# EAGLE design PiGRRL-ButtonPCB (EAGLE 7.5.0)
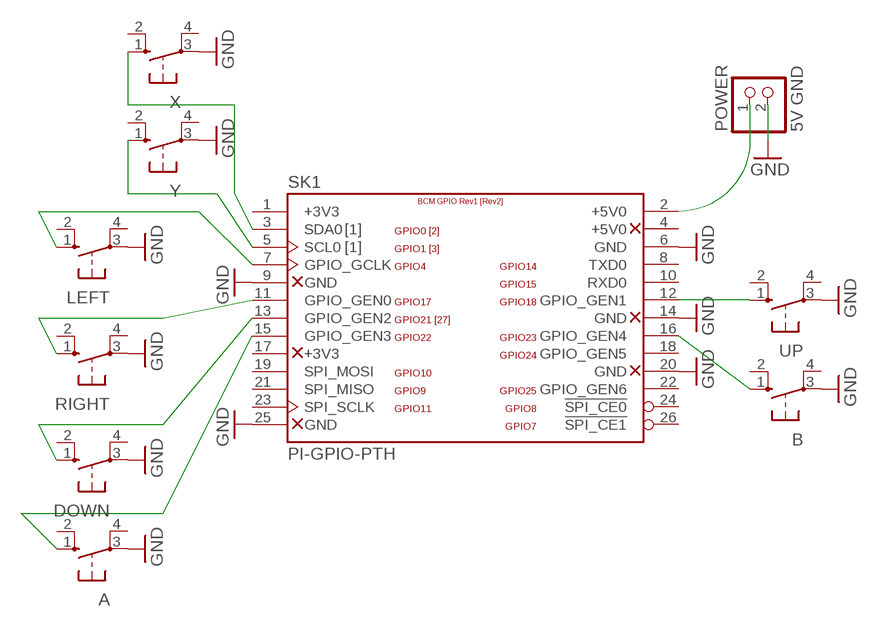
[diagram p0: schematic, sheet 1]

## Parts
A  10-XX  [B3F-10XX]
B  10-XX  [B3F-10XX]
DOWN  10-XX  [B3F-10XX]
LEFT  10-XX  [B3F-10XX]
POWER  5V GND  PINHD-1X2  [1X02]
RIGHT  10-XX  [B3F-10XX]
SK1  PI-GPIO-PTH  [GPIO-CONNECTOR]
UP  10-XX  [B3F-10XX]
X  10-XX  [B3F-10XX]
Y  10-XX  [B3F-10XX]

## Nets
GND: A.3(P) B.3(P) DOWN.3(P) LEFT.3(P) POWER.2 RIGHT.3(P) SK1.6(GND) SK1.9(GND) SK1.14(GND) SK1.20(GND) SK1.25(GND) UP.3(P) X.3(P) Y.3(P)
N$1: LEFT.1(S) SK1.7(GPIO_GCLK)
N$2: RIGHT.1(S) SK1.11(GPIO_GEN0)
N$3: SK1.12(GPIO_GEN1) UP.1(S)
N$4: DOWN.1(S) SK1.13(GPIO_GEN2)
N$5: A.1(S) SK1.15(GPIO_GEN3)
N$6: B.1(S) SK1.16(GPIO_GEN4)
N$7: SK1.5(SCL0) Y.1(S)
N$8: SK1.3(SDA0) X.1(S)
N$9: POWER.1 SK1.2(+5V0)
Unconnected: A.2(S1) A.4(P1) B.2(S1) B.4(P1) DOWN.2(S1) DOWN.4(P1) LEFT.2(S1) LEFT.4(P1) RIGHT.2(S1) RIGHT.4(P1) SK1.4(+5V0) SK1.8(TXD0) SK1.10(RXD0) SK1.17(+3V3) SK1.18(GPIO_GEN5) SK1.19(SPI_MOSI) SK1.21(SPI_MISO) SK1.22(GPIO_GEN6) SK1.23(SPI_SCLK) SK1.24(!SPI_CE0) SK1.26(!SPI_CE1) UP.2(S1) UP.4(P1) X.2(S1) X.4(P1) Y.2(S1) Y.4(P1)

## Power pins joined to a net without a drawn wire
+3V3: SK1.1(+3V3)

## Library data of the parts
A B DOWN LEFT RIGHT UP X Y = switch-omron:10-XX: OMRON SWITCH; MPN: B3F-1000; OC_FARNELL: 176432; OC_NEWARK: 36M3542
POWER = pinhead:PINHD-1X2: PIN HEADER
SK1 = jt-raspberry-pi:PI-: Raspberry Pi

## Net classes
0 default: width 0.305 mm, drill 0.508 mm, clearance 0.254 mm

## Board
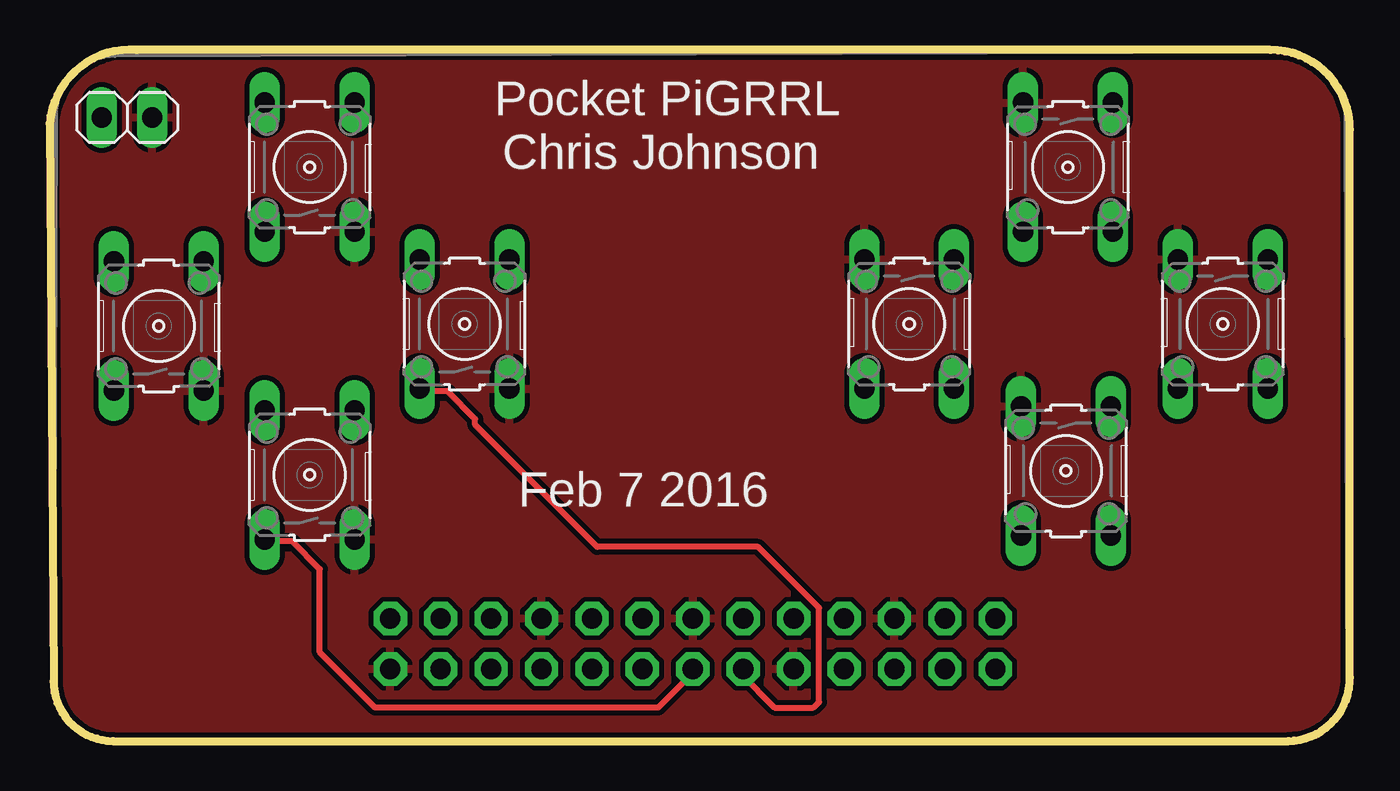
[diagram p1: board, top side]
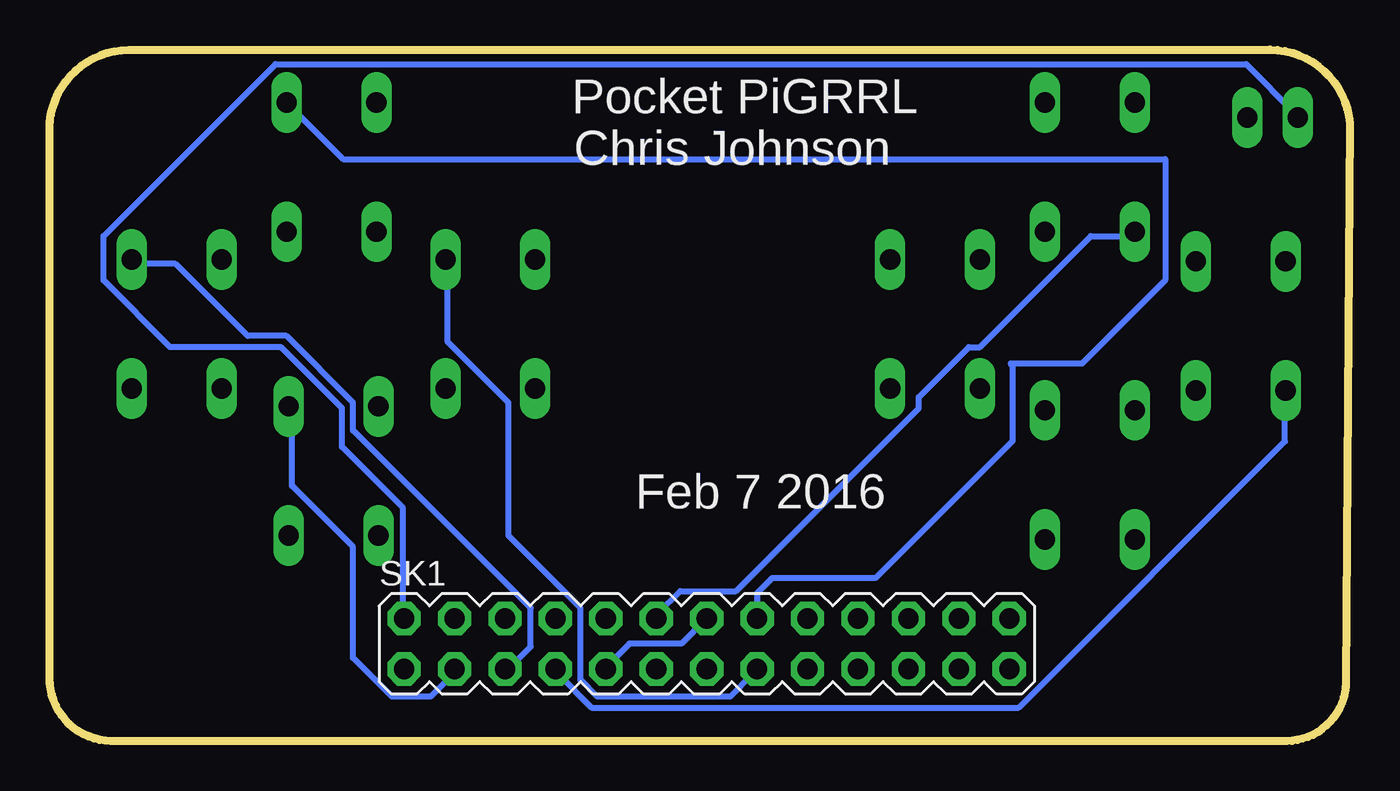
[diagram p2: board, bottom side, seen from below]

Size 65.5 x 34.82 mm. Coordinates in mm from the lower left corner, seen from the top.
Outline: 62.4,0 arc90 65.5,3.2 65.5,30.8 arc90 61.5,34.8 4.4,34.8 arc90 0,31.1 0.2,3 arc90 3.2,0 62.4,0
Copper layers (1*16): Top 0.035mm / dielectric 1.5mm / Bottom 0.035mm
Design rules "adafruit": minimum track width 8mil, minimum drill 15.5mil, track to track 8mil, track to pad 8mil, pad to pad 8mil, via to via 8mil, smd to smd 8mil, copper to edge 10mil, drill to drill 8mil, minimum pad ring 10mil, minimum via ring 8mil, stop-mask expansion 2mil, vias tented up to drill 20mil, thermal gap 10mil

### Footprints (pad centres in the part's own frame; a part is rotated, then mirrored left to right if it is on the bottom)
B3F-10XX = drill 1.016 long: 1 -3.251,2.261; 2 3.251,2.261; 3 -3.251,-2.261; 4 3.251,-2.261
1X02 = drill 1.016 long: 1 -1.27,0; 2 1.27,0
GPIO-CONNECTOR = drill 1.016 pad 1.676 octagon: 1 -15.24,-1.27; 2 -15.24,1.27; 3 -12.7,-1.27; 4 -12.7,1.27; 5 -10.16,-1.27; 6 -10.16,1.27; 7 -7.62,-1.27; 8 -7.62,1.27; 9 -5.08,-1.27; 10 -5.08,1.27; 11 -2.54,-1.27; 12 -2.54,1.27; 13 0,-1.27; 14 0,1.27; 15 2.54,-1.27; 16 2.54,1.27; 17 5.08,-1.27; 18 5.08,1.27; 19 7.62,-1.27; 20 7.62,1.27; 21 10.16,-1.27; 22 10.16,1.27; 23 12.7,-1.27; 24 12.7,1.27; 25 15.24,-1.27; 26 15.24,1.27

### Placement (x,y rotation side)
A  43.3,21 270 top
B  51.3,28.9 270 top
DOWN  13.1,13.4 90 top
LEFT  5.5,20.9 90 top
POWER  3.9,31.4 0 top
RIGHT  20.9,21 90 top
SK1  32.4,4.9 0 bottom
UP  13.1,28.9 90 top
X  51.2,13.6 270 top
Y  59.1,21 270 top

### Tracks (layer width: path | path; a pad name or v marks a point on that pad's centre or on a via)
GND
  Bottom 0.305: SK1.14 33.67,4.9 36.3,4.9 37.48,3.72 SK1.9
  pour Top: 0.7,3 0.7,31.6 arc-90 3.2,34.1 62,34.1 arc-90 64.9,31.5 64.9,3 arc-90 61.9,0.5 3.2,0.5 arc-90
N$1
  Bottom 0.305: LEFT.1 3.27,17.6 3.27,15.09 16.68,1.68 38.2,1.68 39.88,3.35 SK1.7
N$2
  Top 0.305: RIGHT.1 18.64,17.6 20.04,17.6 21.43,16.2 21.43,15.93 27.58,9.78 35.68,9.78 38.76,6.71 38.76,1.96 38.48,1.68 36.52,1.68 34.85,3.35 SK1.11
N$3
  Bottom 0.305: UP.1 11.1,25.43 13.05,25.43 18.64,19.84 19.2,19.84 21.71,17.32 21.71,16.76 30.93,7.54 33.73,7.54 34.85,6.43 SK1.12
N$4
  Top 0.305: DOWN.1 11.1,10.06 12.21,10.06 13.61,8.66 13.61,4.47 16.4,1.68 30.65,1.68 32.33,3.35 SK1.13
N$5
  Bottom 0.305: A.1 45.46,24.03 45.46,20.12 42.39,17.04 42.39,10.34 38.76,6.71 38.76,3.07 37.92,2.23 31.21,2.23 30.1,3.35 SK1.15
N$6
  Bottom 0.305: B.1 50.71,29.3 9.3,29.3 9.3,23.2 13.5,19 17.1,19 17,18.9 17,15.1 23.9,8.2 29.1,8.2 29.86,7.44 SK1.16
N$7
  Bottom 0.305: Y.1 61.11,24.03 59.15,24.03 55.52,20.4 53.57,20.4 50.21,17.04 50.21,15.65 41.27,6.71 41.27,4.75 42.39,3.63 SK1.5
N$8
  Bottom 0.305: X.1 53.29,16.76 53.29,12.85 50.21,9.78 50.21,4.19 48.26,2.23 46.3,2.23 45.18,3.35 SK1.3
N$9
  Bottom 0.305: POWER.1 2.72,31.57 5.23,34.09 54.12,34.09 62.79,25.43 62.79,23.19 59.43,19.84 53.85,19.84 50.77,16.76 50.77,14.81 47.7,11.73 47.7,6.43 SK1.2

### Text on the board
tPlace: Pocket PiGRRL | Chris Johnson | Feb 7 2016
bPlace: Pocket PiGRRL | Chris Johnson | Feb 7 2016